# EAGLE design tssop2dip (EAGLE 4.16)
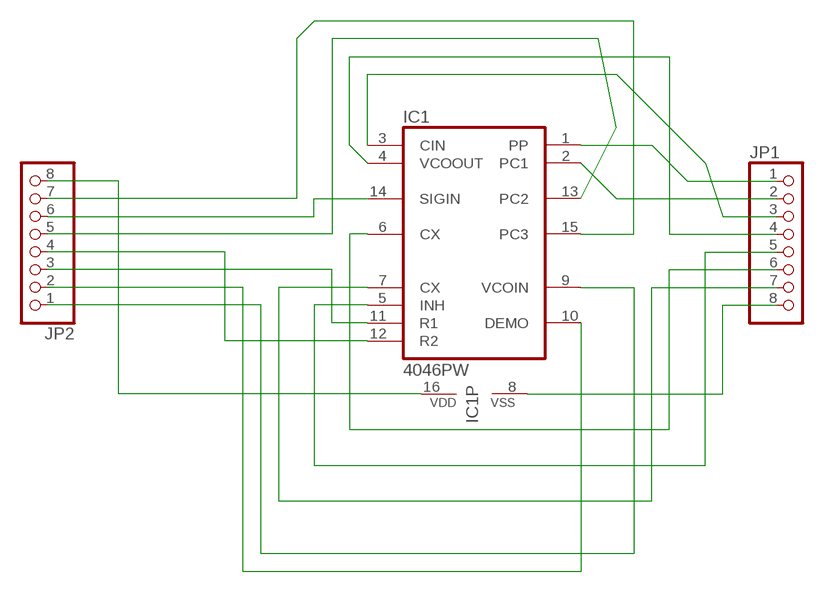
[diagram p0: schematic, sheet 1]

## Parts
IC1  4046PW  [TSSOP16]
JP1  PINHD-1X8  [1X08]
JP2  PINHD-1X8  [1X08]

## Nets
N$1: IC1.1(PP) JP1.1
N$2: IC1.2(PC1) JP1.2
N$3: IC1.3(CIN) JP1.3
N$4: IC1.4(VCOOUT) JP1.4
N$5: IC1.5(INH) JP1.5
N$6: IC1.6(CX) JP1.6
N$7: IC1.7(CX) JP1.7
N$8: IC1.8(VSS) JP1.8
N$9: IC1.9(VCOIN) JP2.1
N$10: IC1.10(DEMO) JP2.2
N$11: IC1.11(R1) JP2.3
N$12: IC1.12(R2) JP2.4
N$13: IC1.13(PC2) JP2.5
N$14: IC1.14(SIGIN) JP2.6
N$15: IC1.15(PC3) JP2.7
N$16: IC1.16(VDD) JP2.8

## Library data of the parts
IC1 = 74hc(t)4046:4046: Micropower PLL
JP1 JP2 = pinhead:PINHD-1X8: PIN HEADER

## Board
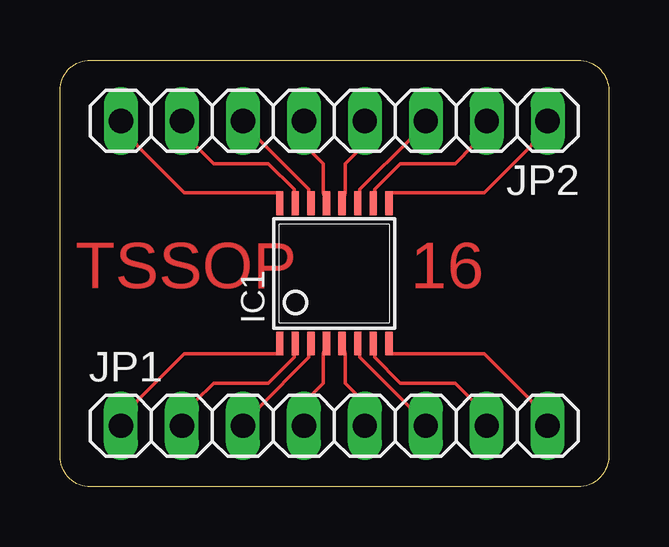
[diagram p1: board, top side]

Size 22.86 x 17.78 mm. Coordinates in mm from the lower left corner, seen from the top.
Outline: 0,16.51 arc-90 1.27,17.78 21.59,17.78 arc-90 22.86,16.51 22.86,1.27 arc-90 21.59,0 1.27,0 arc-90 0,1.27 0,16.51
Copper layers (1*16): Top 0.035mm / dielectric 1.5mm / Bottom 0.035mm
Design rules "PCB-POOL": minimum track width 6mil, minimum drill 12mil, track to track 6mil, track to pad 6mil, pad to pad 6mil, via to via 6mil, smd to smd 6mil, copper to edge 20mil, drill to drill 8mil, minimum pad ring 8mil, minimum via ring 6mil, stop-mask expansion 3mil, vias tented up to drill 0mil, thermal gap 8mil

### Footprints (pad centres in the part's own frame; a part is rotated, then mirrored left to right if it is on the bottom)
TSSOP16 = smd 0.305 x 0.991: 1 -2.275,-2.918; 2 -1.625,-2.918; 3 -0.975,-2.918; 4 -0.325,-2.918; 5 0.325,-2.918; 6 0.975,-2.918; 7 1.625,-2.918; 8 2.275,-2.918; 9 2.275,2.918; 10 1.625,2.918; 11 0.975,2.918; 12 0.325,2.918; 13 -0.325,2.918; 14 -0.975,2.918; 15 -1.625,2.918; 16 -2.275,2.918
1X08 = drill 1.016 long: 1 -8.89,0; 2 -6.35,0; 3 -3.81,0; 4 -1.27,0; 5 1.27,0; 6 3.81,0; 7 6.35,0; 8 8.89,0

### Placement (x,y rotation side)
IC1  11.43,8.89 0 top
JP1  11.43,2.54 0 top
JP2  11.43,15.24 180 top

### Tracks (layer width: path | path; a pad name or v marks a point on that pad's centre or on a via)
N$1
  Top 0.152: IC1.1 9.14,5.54 5.18,5.54 3.2,3.56 JP1.1
N$2
  Top 0.152: IC1.2 9.75,5.54 9.75,5.39 8.69,4.32 6.4,4.32 5.64,3.56 JP1.2
N$3
  Top 0.152: IC1.3 10.36,5.54 10.36,5.39 8.23,3.25 JP1.3
N$4
  Top 0.152: IC1.4 10.97,5.54 10.97,4.32 10.52,3.86 JP1.4
N$5
  Top 0.152: IC1.5 11.89,5.54 11.89,4.32 12.34,3.86 JP1.5
N$6
  Top 0.152: IC1.6 12.5,5.54 12.5,5.39 14.63,3.25 JP1.6
N$7
  Top 0.152: IC1.7 13.11,5.54 13.11,5.39 14.17,4.32 16.46,4.32 17.22,3.56 JP1.7
N$8
  Top 0.152: IC1.8 13.72,5.54 17.68,5.54 19.66,3.56 JP1.8
N$9
  Top 0.152: IC1.9 13.72,12.24 17.68,12.24 19.66,14.22 JP2.1
N$10
  Top 0.152: IC1.10 13.11,12.24 13.11,12.39 14.17,13.46 16.46,13.46 17.22,14.22 JP2.2
N$11
  Top 0.152: IC1.11 12.5,12.24 12.5,12.39 14.63,14.53 JP2.3
N$12
  Top 0.152: IC1.12 11.89,12.24 11.89,13.46 12.34,13.92 JP2.4
N$13
  Top 0.152: IC1.13 10.97,12.24 10.97,13.46 10.52,13.92 JP2.5
N$14
  Top 0.152: IC1.14 10.36,12.24 10.36,12.39 8.23,14.53 JP2.6
N$15
  Top 0.152: IC1.15 9.75,12.24 9.75,12.39 8.69,13.46 6.4,13.46 5.64,14.22 JP2.7
N$16
  Top 0.152: IC1.16 9.14,12.24 5.18,12.24 3.2,14.22 JP2.8

### Text on the board
Top: TSSOP | 16